# Altium schematic sheet INA.SchDoc
size 209 x 297 mm; DocumentCode: Децимальный номер; SchemeType: Схема электрическая принципиальная; PageSetup: Record=PageOptionsZCenterHorizontal=TrueZCenterVertical=TrueZPrintScale=0.95ZXCorrection=1.00ZYCorrection=1.00ZPrintKind=2ZBorderSize=5000000ZLeftOffset=0ZBottomOffset=0ZOrientation=1ZPaperLength=1000ZPaperWidth=1000ZScale=100ZPaperSource=7ZPrintQuality=600ZMediaType=1ZDitherType=10ZPaperKind=A4 (210 x 297 мм)ZPrintScaleMode=1
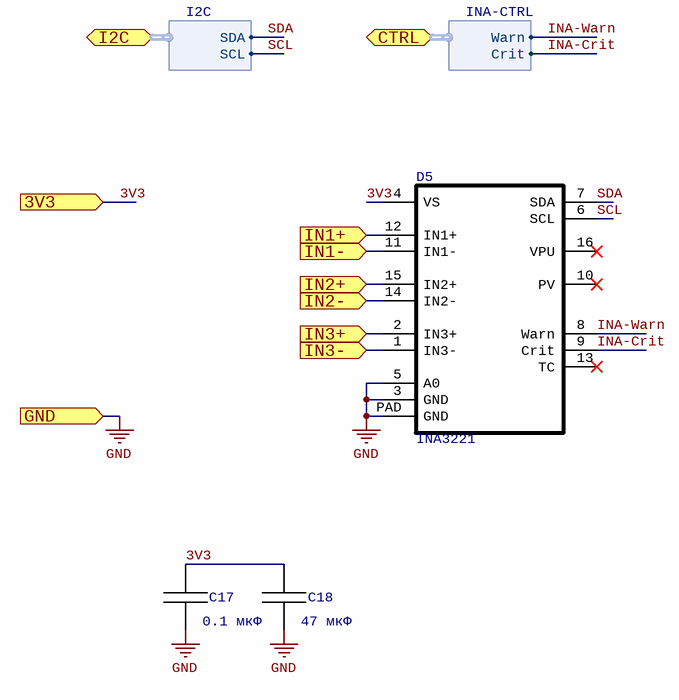
[diagram p0: INA.SchDoc]

## Parts
C17  value 0.1 мкФ  [STD-0402]  (hidden comment: cap)
C18  value 47 мкФ  [STD-0805]  (hidden comment: cap)
D5  INA3221  [VQFN-16]

## Ports
3V3 (in), CTRL (harness INA-CTRL), GND (in), I2C (harness I2C), IN1+ (in), IN1- (in), IN2+ (in), IN2- (in), IN3+ (in), IN3- (in)

## Harnesses
I2C: SDA, SCL
INA-CTRL: Warn, Crit

## Nets
GND: C17.1 C18.1 D5.3(GND) D5.5(A0) D5.PAD(GND) ; port GND
3V3: C17.2 C18.2 D5.4(VS) ; port 3V3
IN1+: D5.12(IN1+) ; port IN1+
IN1-: D5.11(IN1-) ; port IN1-
IN2+: D5.15(IN2+) ; port IN2+
IN2-: D5.14(IN2-) ; port IN2-
IN3+: D5.2(IN3+) ; port IN3+
IN3-: D5.1(IN3-) ; port IN3-
INA-Crit: D5.9(Crit) ; port CTRL.Crit
INA-Warn: D5.8(Warn) ; port CTRL.Warn
SCL: D5.6(SCL) ; port I2C.SCL
SDA: D5.7(SDA) ; port I2C.SDA

Not connected (* = marked no-connect by the designer): D5 10(PV)* 13(TC)* 16(VPU)*

## Notes on the sheet
- Перв. примен.
- Справ. №
- Подп. и дата
- Инв. № дубл.
- Взам. инв. №
- Изм.
- Лист
- № докум.
- Подп.
- Дата
- Инв. № подл.
- Копировал
- Формат А4

## Library data of the parts
C17 = C0402-0u1-50v-10%-X7R: Конденсатор; Part Number: C0402-0u1-50v-10%-X7R
C18 = C0805-47u-6.3v-20%-X5R: Конденсатор; Part Number: C0805-47u-6.3v-20%-X5R
D5 = INA3221AIRGVT: Монитор питания; Part Number: INA3221AIRGVT